# EAGLE design bbarduino (EAGLE 7.1.0)
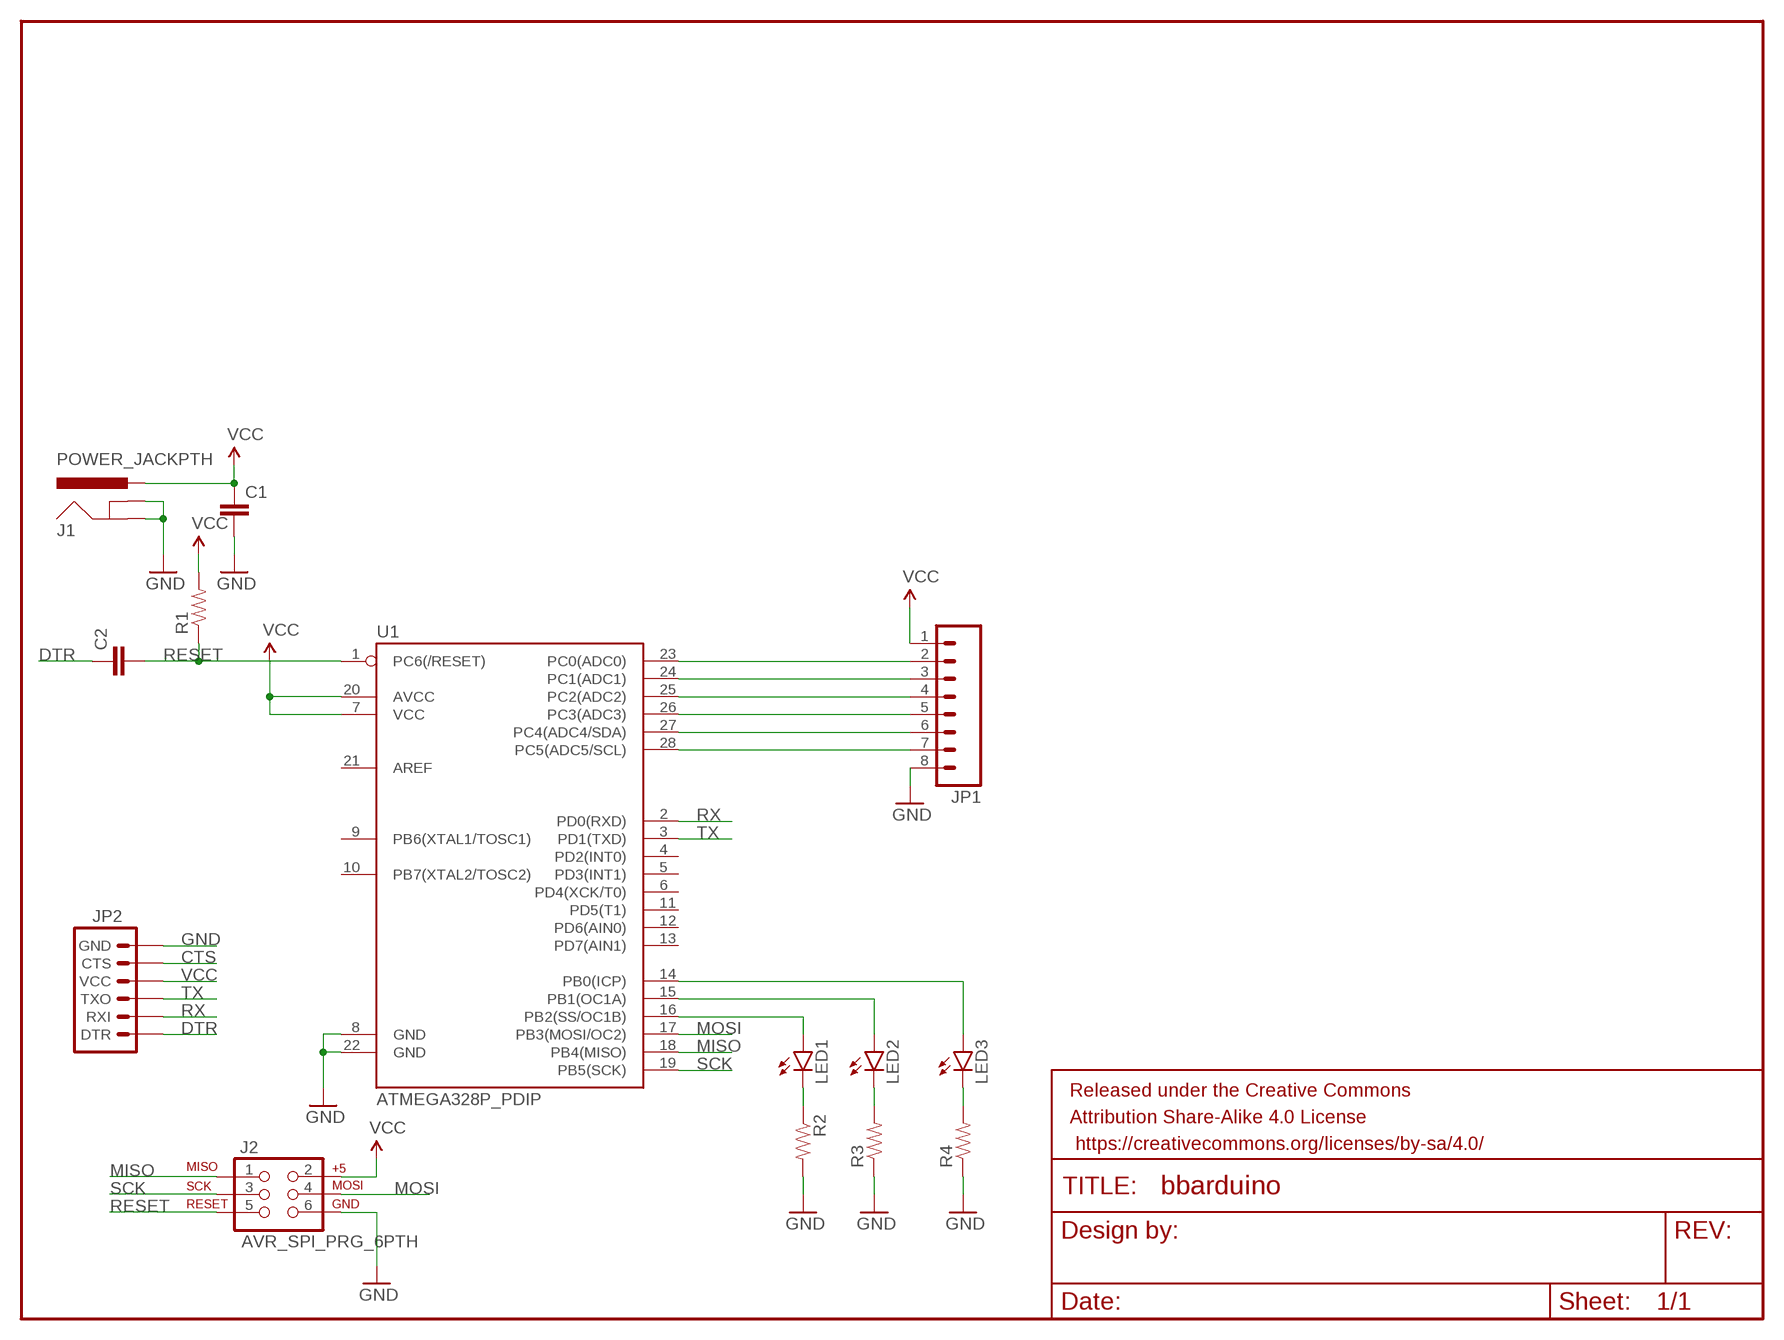
[diagram p0: schematic, sheet 1]

## Parts
C1  CAPPTH  [CAP-PTH-SMALL]
C2  CAPPTH  [CAP-PTH-SMALL]
FRAME1  FRAME-LETTER  [CREATIVE_COMMONS]
J1  POWER_JACKPTH  [POWER_JACK_PTH]
J2  AVR_SPI_PRG_6PTH  [2X3]
JP1  M081X08  [1X08]
JP2  ARDUINO_SERIAL_PROGRAMPTH  [1X06]
LED1  LED5MM  [LED5MM]
LED2  LED5MM  [LED5MM]
LED3  LED5MM  [LED5MM]
R1  RESISTORPTH-1/4W  [AXIAL-0.4]
R2  RESISTORPTH-1/4W  [AXIAL-0.4]
R3  RESISTORPTH-1/4W  [AXIAL-0.4]
R4  RESISTORPTH-1/4W  [AXIAL-0.4]
U1  ATMEGA328P_PDIP  [DIL28-3]

## Nets
CTS: JP2.CTS
DTR: C2.1 JP2.DTR
GND: C1.2 J1.GND J1.GNDBREAK J2.6 JP1.8 JP2.GND R2.P$2 R3.P$1 R4.P$1 U1.8(GND) U1.22(GND)
MISO: J2.1 U1.18(PB4(MISO))
MOSI: J2.4 U1.17(PB3(MOSI/OC2))
N$1: LED1.K(C) R2.P$1
N$3: JP1.2 U1.23(PC0(ADC0))
N$4: JP1.3 U1.24(PC1(ADC1))
N$5: JP1.4 U1.25(PC2(ADC2))
N$6: JP1.5 U1.26(PC3(ADC3))
N$7: JP1.6 U1.27(PC4(ADC4/SDA))
N$8: JP1.7 U1.28(PC5(ADC5/SCL))
N$9: LED1.A U1.16(PB2(SS/OC1B))
N$10: LED2.A U1.15(PB1(OC1A))
N$11: LED3.A U1.14(PB0(ICP))
N$12: LED2.K(C) R3.P$2
N$13: LED3.K(C) R4.P$2
RESET: C2.2 J2.5 R1.P$1 U1.1(PC6(/RESET))
RX: JP2.RXI U1.2(PD0(RXD))
SCK: J2.3 U1.19(PB5(SCK))
TX: JP2.TXO U1.3(PD1(TXD))
VCC: C1.1 J1.PWR J2.2 JP1.1 JP2.VCC R1.P$2 U1.7(VCC) U1.20(AVCC)
Unconnected: U1.4(PD2(INT0)) U1.5(PD3(INT1)) U1.6(PD4(XCK/T0)) U1.9(PB6(XTAL1/TOSC1)) U1.10(PB7(XTAL2/TOSC2)) U1.11(PD5(T1)) U1.12(PD6(AIN0)) U1.13(PD7(AIN1)) U1.21(AREF)

## Library data of the parts
C1 = SparkFun-Passives:CAP: Capacitor Standard 0603 ceramic capacitor, and 0.1" leaded capacitor.
C2 = SparkFun-Capacitors:CAP: Capacitor Standard 0603 ceramic capacitor, and 0.1" leaded capacitor.
FRAME1 = SparkFun-Aesthetics:FRAME-LETTER: Schematic Frame Standard 8.5x11 US Letter frame
J1 = SparkFun-Connectors:POWER_JACK: Power Jack This is the standard 5.5mm barrel jack for power. The PTH is the most common, proven, reliable, footprint. The Slot footprint only works if the mill layer is transmitted to the PCB fab house so be warned. Mating wall wart : TOL-00298 (and others); PROD_ID: PRT-00119
J2 = SparkFun-Connectors:AVR_SPI_PRG_6: AVR ISP 6 Pin This is the reduced ISP connector for AVR programming. Common on Arduino. This footprint will take up less PCB space and can be used with a 10-pin to 6-pin adapter such as SKU: BOB-08508 **Special note about "TEST_POINT" package. The stop mask is on the top side, so if you want your programming test points to be on the bottom of your board, make sure to place this package on the bottom side of the board. This also ensure that the orientation to program from the bottom side will be correct.
JP1 = SparkFun-Connectors:M08: Header 8 Standard 8-pin 0.1" header. Use with straight break away headers (SKU : PRT-00116), right angle break away headers (PRT-00553), swiss pins (PRT-00743), machine pins (PRT-00117), and female headers (PRT-00115).
JP2 = SparkFun-Connectors:ARDUINO_SERIAL_PROGRAM: FTDI connector footprints
LED1-LED3 = SparkFun-LED:LED: LEDs Standard schematic elements and footprints for 5mm, 3mm, 1206, and 0603 sized LEDs. 5mm - Spark Fun Electronics SKU : COM-00529 (and others)
R1-R4 = SparkFun-Resistors:RESISTOR: Resistor Basic schematic elements and footprints for 0603, 1206, and PTH resistors.
U1 = SparkFun-DigitalIC:ATMEGA328P_PDIP: uC used in the Arduino 32kb flash, 1k EEPROM, 2k SRAM This is the through-hole version of this chip.

## Board
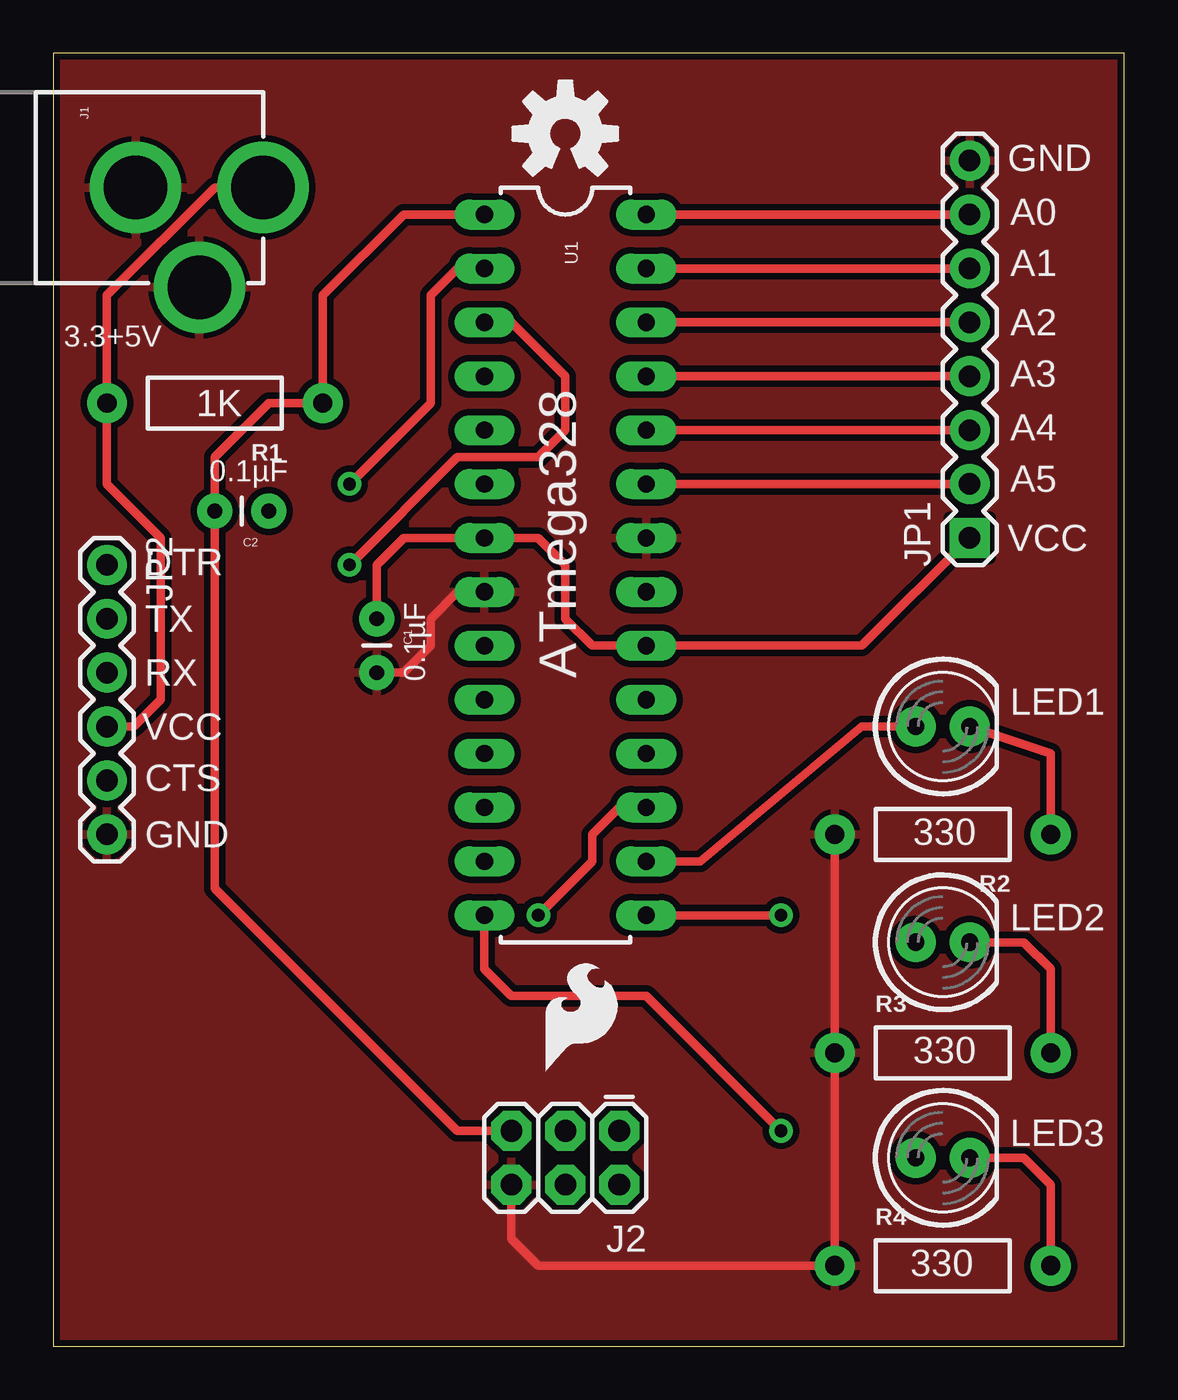
[diagram p1: board, top side]
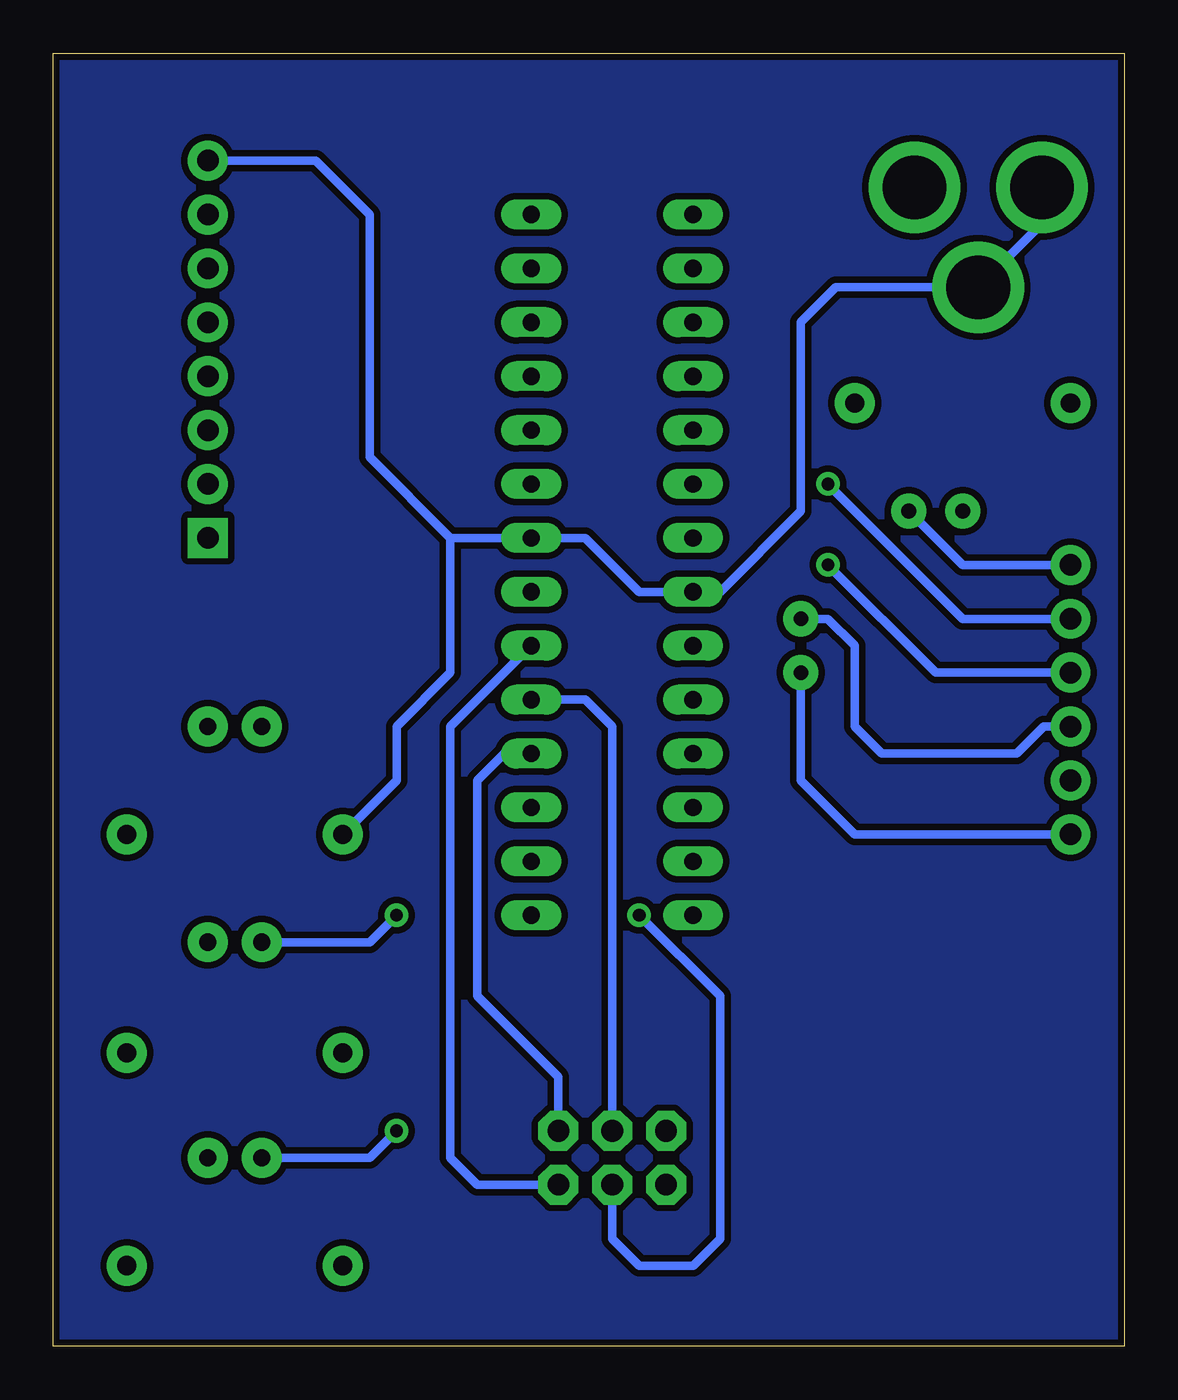
[diagram p2: board, bottom side, seen from below]

Size 50.47 x 60.95 mm. Coordinates in mm from the lower left corner, seen from the top.
Outline: 0,0 50.47,0 50.47,60.95 0,60.95 0,0
Copper layers (1*16): Top 0.035mm / dielectric 1.5mm / Bottom 0.035mm
Design rules "SparkFun": minimum track width 8mil, minimum drill 20mil, track to track 8mil, track to pad 8mil, pad to pad 8mil, via to via 8mil, smd to smd 8mil, copper to edge 8mil, drill to drill 8mil, minimum pad ring 12mil, minimum via ring 10mil, stop-mask expansion 4mil, vias tented up to drill 20mil, thermal gap 10mil

### Footprints (pad centres in the part's own frame; a part is rotated, then mirrored left to right if it is on the bottom)
CAP-PTH-SMALL = drill 0.7 pad 1.651: 1 0,0; 2 2.54,0
POWER_JACK_PTH = drill 2.997 pad 4.318: GND 0,7.7; GNDBREAK 4.7,10.7; PWR 0,13.7
2X3 = drill 1.016 pad 1.88 octagon: 1 0,0; 2 0,2.54; 3 2.54,0; 4 2.54,2.54; 5 5.08,0; 6 5.08,2.54
1X08 = drill 1.016 pad 1.88 square: 1 0,0 | drill 1.016 pad 1.88: 2 2.54,0; 3 5.08,0; 4 7.62,0; 5 10.16,0; 6 12.7,0; 7 15.24,0; 8 17.78,0
1X06 = drill 1.016 pad 1.88: CTS 10.16,0; DTR 0,0; GND 12.7,0; RXI 2.54,0; TXO 5.08,0; VCC 7.62,0
LED5MM = drill 0.813 pad 1.88: A -1.27,0; K 1.27,0
AXIAL-0.4 = drill 0.9 pad 1.88: P$1 -5.08,0; P$2 5.08,0
DIL28-3 = drill 0.813 long: 1 -16.51,-3.81; 2 -13.97,-3.81; 3 -11.43,-3.81; 4 -8.89,-3.81; 5 -6.35,-3.81; 6 -3.81,-3.81; 7 -1.27,-3.81; 8 1.27,-3.81; 9 3.81,-3.81; 10 6.35,-3.81; 11 8.89,-3.81; 12 11.43,-3.81; 13 13.97,-3.81; 14 16.51,-3.81; 15 16.51,3.81; 16 13.97,3.81; 17 11.43,3.81; 18 8.89,3.81; 19 6.35,3.81; 20 3.81,3.81; 21 1.27,3.81; 22 -1.27,3.81; 23 -3.81,3.81; 24 -6.35,3.81; 25 -8.89,3.81; 26 -11.43,3.81; 27 -13.97,3.81; 28 -16.51,3.81

### Placement (x,y rotation side)
C1  15.24,34.29 270 top
C2  10.16,39.37 180 top
FRAME1  16.51,-8.89 0 top  (outside the outline)
J1  -3.81,54.61 270 top
J2  26.67,10.16 180 top
JP1  43.18,38.1 90 top
JP2  2.54,36.83 270 top
LED1  41.91,29.21 0 top
LED2  41.91,19.05 0 top
LED3  41.91,8.89 0 top
R1  7.62,44.45 180 top
R2  41.91,24.13 180 top
R3  41.91,13.84 0 top
R4  41.91,3.81 0 top
U1  24.13,36.83 270 top
U$1  [SFE_LOGO_FLAME_.2]  22.86,12.7 0 top
U$2  [OSHW-LOGO-M]  24.13,57.15 0 top

### Tracks (layer width: path | path; a pad name or v marks a point on that pad's centre or on a via)
DTR
  Bottom 0.406: JP2.DTR 7.62,36.83 C2.1
GND
  Top 0.406: J2.6 21.59,5.08 22.86,3.81 R4.P$1 | C1.2 16.51,31.75 17.78,33.02 17.78,34.29 19.05,35.56 U1.8 | R4.P$1 R3.P$1 | R4.P$1 R2.P$2
  Bottom 0.406: JP2.GND 12.7,24.13 15.24,26.67 C1.2 | 31.75,38.1 U1.22 25.4,38.1 22.86,35.56 U1.8 19.05,35.56 15.24,39.37 15.24,48.26 13.59,49.91 J1.GNDBREAK 3.89,52.91 J1.GND | 31.75,38.1 35.56,41.91 35.56,53.34 38.1,55.88 JP1.8 | 31.75,38.1 31.75,31.75 34.29,29.21 34.29,26.67 R2.P$2
  pour Top (isolate 0.305): 0,60.96 50.8,60.96 50.8,0 0,0
MISO
  Bottom 0.406: J2.1 26.67,12.7 30.48,16.51 30.48,26.67 29.21,27.94 U1.18
MOSI  (via drill 0.6)
  Top 0.406: v22.86,20.32 25.4,22.86 25.4,24.13 26.67,25.4 U1.17
  Bottom 0.406: J2.4 24.13,5.08 22.86,3.81 20.32,3.81 19.05,5.08 19.05,16.51 v22.86,20.32
N$1
  Top 0.406: LED1.K 46.99,27.94 R2.P$1
N$2
  pour Bottom (isolate 0.305): 0,60.96 50.8,60.96 50.8,0 0,0
N$3
  Top 0.406: U1.23 JP1.2
N$4
  Top 0.406: JP1.3 U1.24
N$5
  Top 0.406: U1.25 JP1.4
N$6
  Top 0.406: JP1.5 U1.26
N$7
  Top 0.406: U1.27 JP1.6
N$8
  Top 0.406: JP1.7 U1.28
N$9
  Top 0.406: LED1.A 38.1,29.21 30.48,22.86 U1.16
N$10  (via drill 0.6)
  Top 0.406: v34.29,20.32 U1.15
  Bottom 0.406: LED2.A 35.56,19.05 v34.29,20.32
N$11  (via drill 0.6)
  Top 0.406: v34.29,10.16 27.94,16.51 21.59,16.51 20.32,17.78 U1.14
  Bottom 0.406: LED3.A 35.56,8.89 v34.29,10.16
N$12
  Top 0.406: LED2.K 45.72,19.05 46.99,17.78 R3.P$2
N$13
  Top 0.406: LED3.K 45.72,8.89 46.99,7.62 R4.P$2
RESET
  Top 0.406: J2.5 19.05,10.16 7.62,21.59 C2.2 7.62,41.91 10.16,44.45 R1.P$1 12.7,49.53 16.51,53.34 U1.1
RX  (via drill 0.6)
  Top 0.406: v13.97,40.64 17.78,44.45 17.78,49.53 19.05,50.8 U1.2
  Bottom 0.406: JP2.RXI 7.62,34.29 v13.97,40.64
SCK
  Bottom 0.406: U1.19 25.4,30.48 24.13,29.21 J2.3
TX  (via drill 0.6)
  Top 0.406: v13.97,36.83 19.05,41.91 22.86,41.91 24.13,43.18 24.13,45.72 21.59,48.26 U1.3
  Bottom 0.406: JP2.TXO 8.89,31.75 v13.97,36.83
VCC
  Top 0.406: C1.1 15.24,36.83 16.51,38.1 U1.7 22.86,38.1 24.13,36.83 24.13,34.29 25.4,33.02 U1.20 38.1,33.02 JP1.1 | J1.PWR 7.62,54.61 2.54,49.53 R1.P$2 2.54,40.64 5.08,38.1 5.08,30.48 3.81,29.21 JP2.VCC
  Bottom 0.406: U1.20 31.75,29.21 31.75,8.89 30.48,7.62 J2.2 | JP2.VCC 3.81,29.21 5.08,27.94 11.43,27.94 12.7,29.21 12.7,33.02 13.97,34.29 C1.1

### Text on the board
tPlace: GND | A0 | A1 | A2 | 3.3+5V | A3 | 1K | A4 | 0.1µF | A5 | VCC | DTR | 0.1µF | TX | ATmega328 | RX | VCC | CTS | GND | 330 | 330 | 330